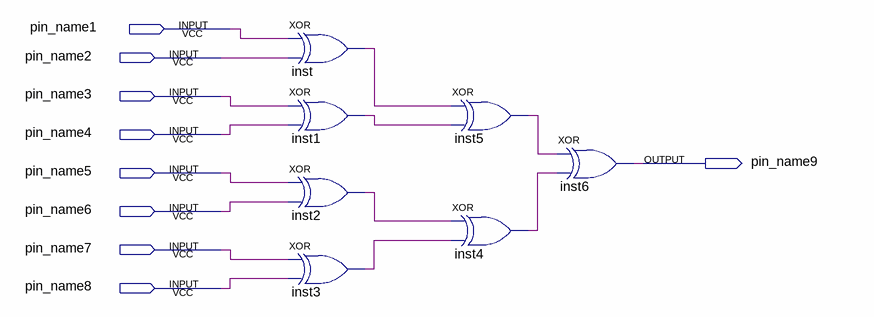
[diagram p0: schematic sheet]
// Quartus schematic design1.bdf as structural Verilog: 7 symbols, 9 pins
module design1 (
  input  pin_name1,
  input  pin_name2,
  input  pin_name3,
  input  pin_name4,
  input  pin_name5,
  input  pin_name6,
  input  pin_name7,
  input  pin_name8,
  output pin_name9
);

  wire inst1_out, inst2_out, inst3_out, inst4_out, inst5_out, inst_out;

  xor inst (inst_out, pin_name1, pin_name2);
  xor inst1 (inst1_out, pin_name3, pin_name4);
  xor inst2 (inst2_out, pin_name5, pin_name6);
  xor inst3 (inst3_out, pin_name7, pin_name8);
  xor inst5 (inst5_out, inst_out, inst1_out);
  xor inst4 (inst4_out, inst2_out, inst3_out);
  xor inst6 (pin_name9, inst5_out, inst4_out);
endmodule
